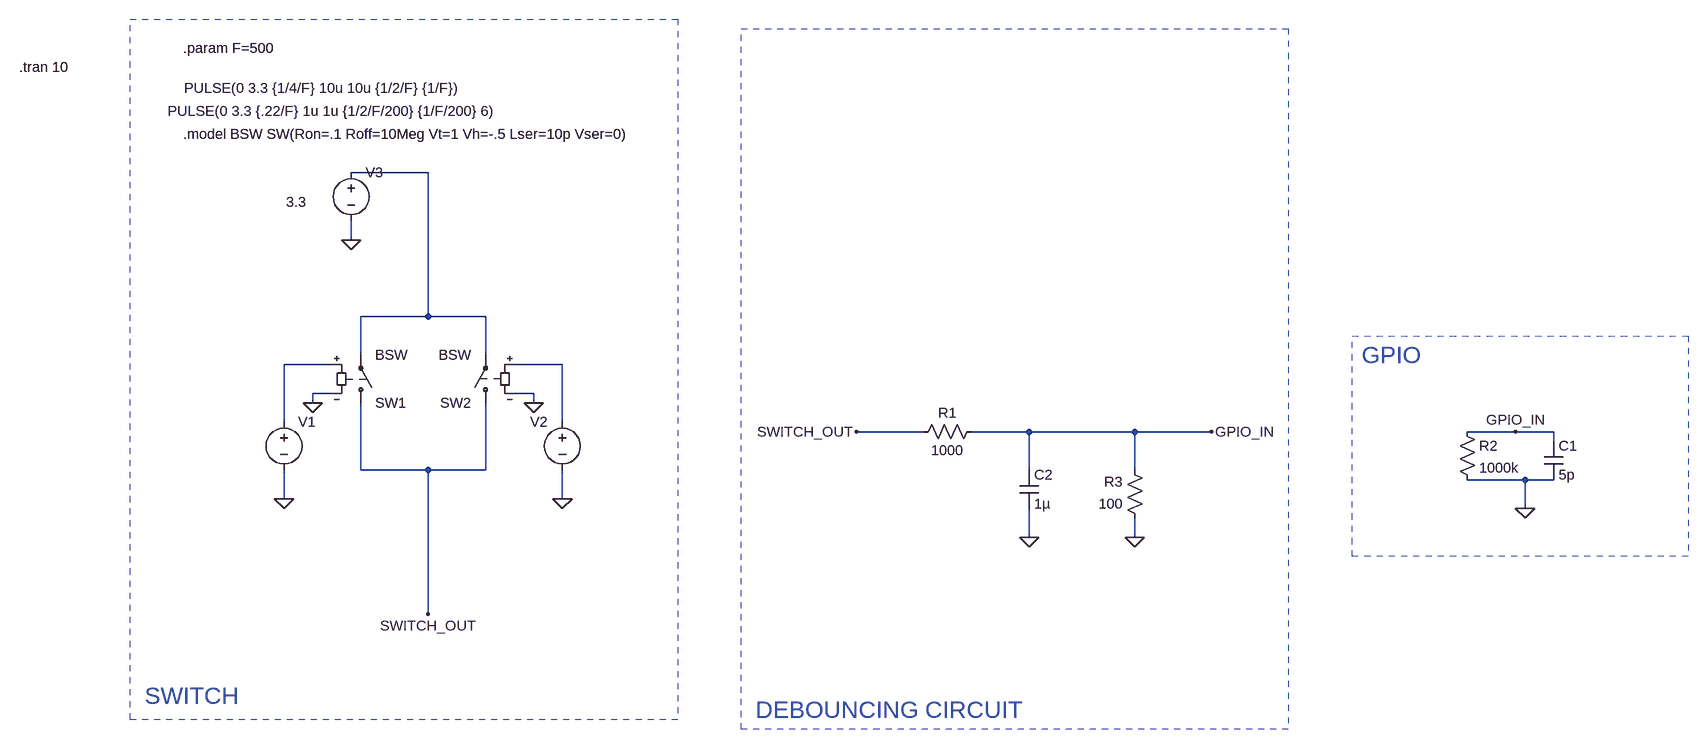
[diagram p0: schematic button_bounce.asc]
button_bounce.asc, the LTspice schematic file:
Version 4
SHEET 1 2884 976
WIRE 368 32 240 32
WIRE 240 144 240 112
WIRE 368 272 368 32
WIRE 368 272 256 272
WIRE 464 272 368 272
WIRE 256 336 256 272
WIRE 464 336 464 272
WIRE 208 352 128 352
WIRE 592 352 512 352
WIRE 208 400 176 400
WIRE 544 400 512 400
WIRE 176 416 176 400
WIRE 544 416 544 400
WIRE 128 448 128 352
WIRE 592 448 592 352
WIRE 1344 464 1232 464
WIRE 1520 464 1424 464
WIRE 1696 464 1520 464
WIRE 1824 464 1696 464
WIRE 2592 464 2512 464
WIRE 2656 464 2592 464
WIRE 2656 480 2656 464
WIRE 256 528 256 416
WIRE 368 528 256 528
WIRE 464 528 464 416
WIRE 464 528 368 528
WIRE 1520 528 1520 464
WIRE 1696 528 1696 464
WIRE 2608 544 2512 544
WIRE 2656 544 2608 544
WIRE 128 576 128 528
WIRE 592 576 592 528
WIRE 2608 592 2608 544
WIRE 1520 640 1520 592
WIRE 1696 640 1696 608
WIRE 368 768 368 528
FLAG 128 576 0
FLAG 2608 592 0
FLAG 2592 464 GPIO_IN
FLAG 1824 464 GPIO_IN
FLAG 176 416 0
FLAG 544 416 0
FLAG 240 144 0
FLAG 592 576 0
FLAG 368 768 SWITCH_OUT
FLAG 1232 464 SWITCH_OUT
FLAG 1520 640 0
FLAG 1696 640 0
SYMBOL voltage 128 432 R0
WINDOW 3 -166 -541 Left 2
WINDOW 123 0 0 Left 0
WINDOW 39 0 0 Left 0
SYMATTR Value PULSE(0 3.3 {1/4/F} 10u 10u {1/2/F} {1/F})
SYMATTR InstName V1
SYMBOL res 2496 448 R0
SYMATTR InstName R2
SYMATTR Value 1000k
SYMBOL cap 2640 480 R0
SYMATTR InstName C1
SYMATTR Value 5p
SYMBOL sw 256 432 M180
SYMATTR InstName SW1
SYMATTR Value BSW
SYMBOL voltage 592 432 M0
WINDOW 3 111 -503 Left 2
WINDOW 123 0 0 Left 0
WINDOW 39 0 0 Left 0
SYMATTR Value PULSE(0 3.3 {.22/F} 1u 1u {1/2/F/200} {1/F/200} 6)
SYMATTR InstName V2
SYMBOL sw 464 432 R180
SYMATTR InstName SW2
SYMATTR Value BSW
SYMBOL voltage 240 16 R0
WINDOW 3 -108 65 Left 2
WINDOW 123 0 0 Left 0
WINDOW 39 0 0 Left 0
SYMATTR Value 3.3
SYMATTR InstName V3
SYMBOL res 1440 448 R90
WINDOW 0 0 56 VBottom 2
WINDOW 3 32 56 VTop 2
SYMATTR InstName R1
SYMATTR Value 1000
SYMBOL res 1712 624 R180
WINDOW 0 36 76 Left 2
WINDOW 3 36 40 Left 2
SYMATTR InstName R3
SYMATTR Value 100
SYMBOL cap 1504 528 R0
SYMATTR InstName C2
SYMATTR Value 1µ
TEXT -400 -144 Left 2 !.tran 10
TEXT -40 -176 Left 2 !.param F=500
TEXT -40 -32 Left 2 !.model BSW SW(Ron=.1 Roff=10Meg Vt=1 Vh=-.5 Lser=10p Vser=0)
TEXT 2336 336 Left 4 ;GPIO
TEXT -104 904 Left 4 ;SWITCH
TEXT 1064 928 Left 4 ;DEBOUNCING CIRCUIT
RECTANGLE Normal 2880 672 2320 304 2
RECTANGLE Normal 784 944 -128 -224 2
RECTANGLE Normal 1952 960 1040 -208 2

The netlist it stands for:
* button_bounce.asc
V1 N002 0 PULSE(0 3.3 {1/4/F} 10u 10u {1/2/F} {1/F})
R2 GPIO_IN 0 1000k
C1 GPIO_IN 0 5p
SW1 SWITCH_OUT N001 N002 0 BSW
V2 N003 0 PULSE(0 3.3 {.22/F} 1u 1u {1/2/F/200} {1/F/200} 6)
SW2 SWITCH_OUT N001 N003 0 BSW
V3 N001 0 3.3
R1 GPIO_IN SWITCH_OUT 1000
R3 0 GPIO_IN 100
C2 GPIO_IN 0 1µ
.tran 10
.param F=500
.model BSW SW(Ron=.1 Roff=10Meg Vt=1 Vh=-.5 Lser=10p Vser=0)
* GPIO
* SWITCH
* DEBOUNCING CIRCUIT
.backanno
.end